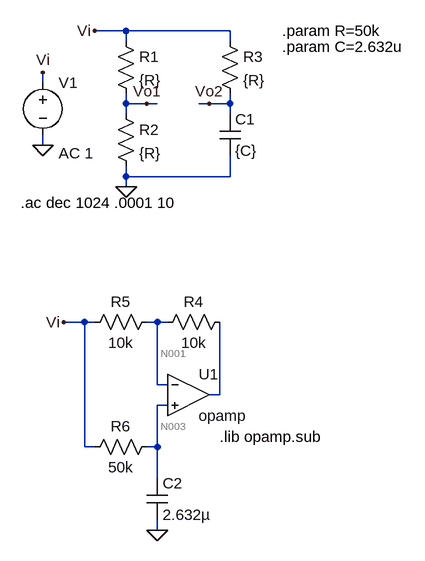
[diagram p0: schematic all_pass_pasivo.asc]
all_pass_pasivo.asc, the LTspice schematic file:
Version 4
SHEET 1 880 836
WIRE 48 48 0 48
WIRE 208 48 48 48
WIRE 48 64 48 48
WIRE 208 64 208 48
WIRE -80 128 -80 112
WIRE 48 160 48 144
WIRE 80 160 48 160
WIRE 96 160 80 160
WIRE 176 160 160 160
WIRE 208 160 208 144
WIRE 208 160 176 160
WIRE 48 176 48 160
WIRE 208 176 208 160
WIRE -80 224 -80 208
WIRE 48 272 48 256
WIRE 208 272 208 240
WIRE 208 272 48 272
WIRE 48 288 48 272
WIRE -16 496 -48 496
WIRE 0 496 -16 496
WIRE 96 496 80 496
WIRE 112 496 96 496
WIRE 96 592 96 496
WIRE 112 592 96 592
WIRE 192 608 192 496
WIRE 192 608 176 608
WIRE 112 624 96 624
WIRE -16 688 -16 496
WIRE 0 688 -16 688
WIRE 96 688 96 624
WIRE 96 688 80 688
WIRE 96 736 96 688
WIRE 96 816 96 800
FLAG 48 288 0
FLAG -80 224 0
FLAG -80 112 Vi
FLAG 0 48 Vi
FLAG 80 160 Vo1
FLAG 176 160 Vo2
FLAG 96 816 0
FLAG -48 496 Vi
SYMBOL res 32 48 R0
SYMATTR InstName R1
SYMATTR Value {R}
SYMBOL cap 192 176 R0
SYMATTR InstName C1
SYMATTR Value {C}
SYMBOL res 32 160 R0
SYMATTR InstName R2
SYMATTR Value {R}
SYMBOL res 192 48 R0
SYMATTR InstName R3
SYMATTR Value {R}
SYMBOL voltage -80 112 R0
WINDOW 123 24 124 Left 2
WINDOW 39 0 0 Left 0
SYMATTR InstName V1
SYMATTR Value ""
SYMATTR Value2 AC 1
SYMBOL OpAmps\\opamp 144 544 R0
SYMATTR InstName U1
SYMBOL res 208 480 R90
WINDOW 0 0 56 VBottom 2
WINDOW 3 32 56 VTop 2
SYMATTR InstName R4
SYMATTR Value 10k
SYMBOL res 96 480 R90
WINDOW 0 0 56 VBottom 2
WINDOW 3 32 56 VTop 2
SYMATTR InstName R5
SYMATTR Value 10k
SYMBOL res 96 672 R90
WINDOW 0 0 56 VBottom 2
WINDOW 3 32 56 VTop 2
SYMATTR InstName R6
SYMATTR Value 50k
SYMBOL cap 80 736 R0
SYMATTR InstName C2
SYMATTR Value 2.632µ
TEXT 288 48 Left 2 !.param R=50k
TEXT 288 72 Left 2 !.param C=2.632u
TEXT -114 312 Left 2 !.ac dec 1024 .0001 10
TEXT 192 672 Left 2 !.lib opamp.sub

The netlist it stands for:
* all_pass_pasivo.asc
R1 Vi Vo1 {R}
C1 Vo2 0 {C}
R2 Vo1 0 {R}
R3 Vi Vo2 {R}
V1 Vi 0 AC 1
XU1 N001 N003 N002 opamp Aol=100K GBW=10Meg  ; pins invin noninvin out
R4 N002 N001 10k
R5 N001 Vi 10k
R6 N003 Vi 50k
C2 N003 0 2.632µ
.param R=50k
.param C=2.632u
.ac dec 1024 .0001 10
.lib opamp.sub
.backanno
.end

* Results of the author's LTspice run, read from the files saved beside the schematic
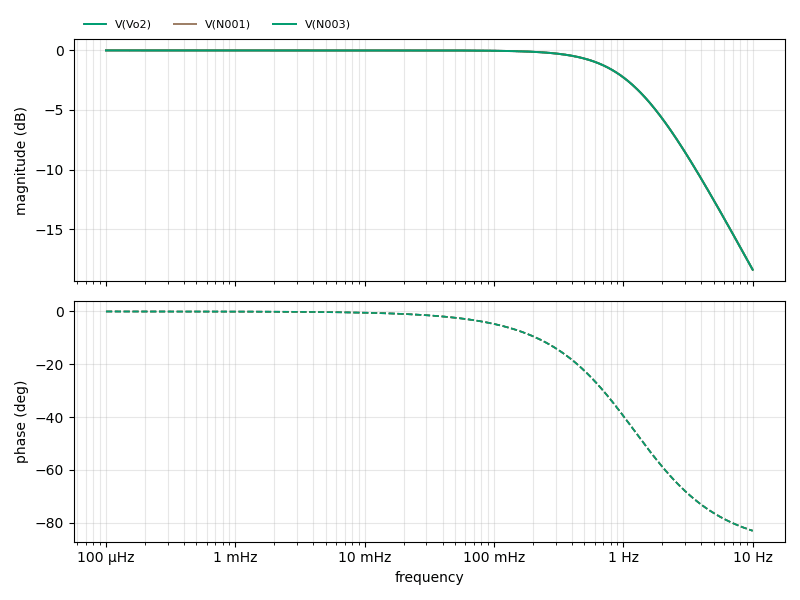
[diagram p1: AC Analysis of all_pass_pasivo.asc, plotted from the saved traces]
* AC Analysis, 1 run:
*   V(Vo2): -0.00 dB at 100 µHz, -18.41 dB at 10 Hz, peak -0.00 dB at 100 µHz, 3 dB below the peak at 1.209 Hz
*   V(N001): -0.00 dB at 100 µHz, -18.41 dB at 10 Hz, peak -0.00 dB at 100 µHz, 3 dB below the peak at 1.209 Hz
*   V(N003): -0.00 dB at 100 µHz, -18.41 dB at 10 Hz, peak -0.00 dB at 100 µHz, 3 dB below the peak at 1.209 Hz